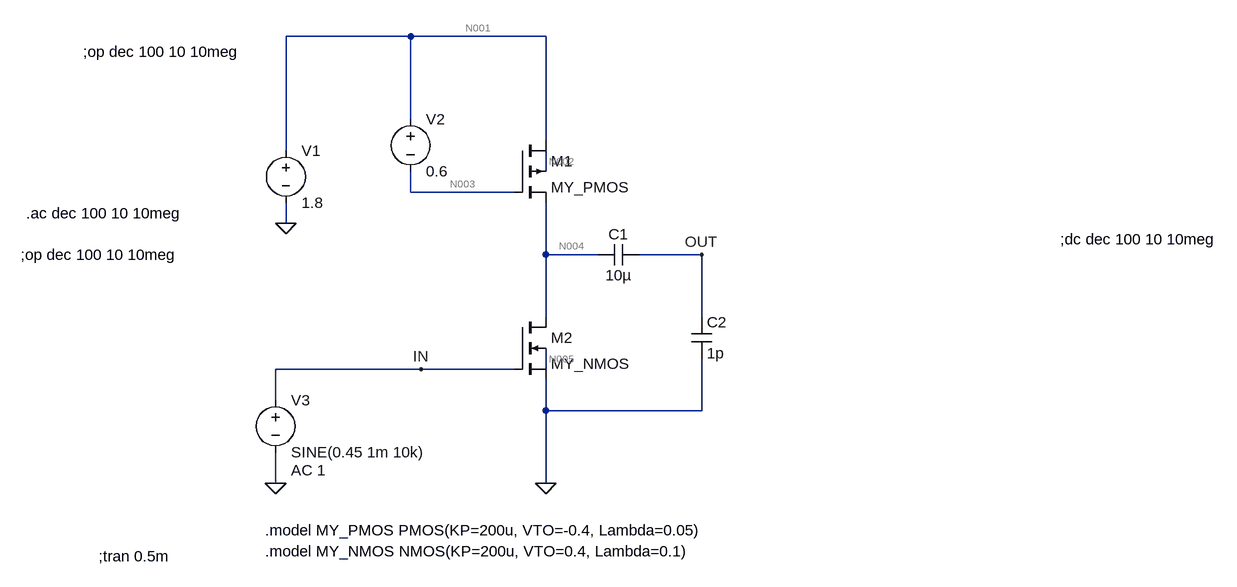
[diagram p0: schematic cs_amp_activeload.asc]
cs_amp_activeload.asc, the LTspice schematic file:
Version 4
SHEET 1 1208 680
WIRE -80 -304 -272 -304
WIRE 128 -304 -80 -304
WIRE -80 -176 -80 -304
WIRE 128 -144 128 -304
WIRE -272 -128 -272 -304
WIRE 128 -96 128 -128
WIRE -80 -64 -80 -96
WIRE 80 -64 -80 -64
WIRE -272 -16 -272 -48
WIRE 128 32 128 -48
WIRE 208 32 128 32
WIRE 368 32 272 32
WIRE 128 128 128 32
WIRE 368 128 368 32
WIRE -64 208 -288 208
WIRE 80 208 -64 208
WIRE 128 208 128 176
WIRE -288 256 -288 208
WIRE 128 272 128 224
WIRE 368 272 368 192
WIRE 368 272 128 272
WIRE -288 384 -288 336
WIRE 128 384 128 272
FLAG -272 -16 0
FLAG -288 384 0
FLAG 128 384 0
FLAG -64 208 IN
FLAG 368 32 OUT
SYMBOL pmos4 80 -144 R0
SYMATTR InstName M1
SYMATTR Value MY_PMOS
SYMATTR Value2 l=180n w=1800n
SYMBOL nmos4 80 128 R0
SYMATTR InstName M2
SYMATTR Value MY_NMOS
SYMATTR Value2 l=180n w=28.8u
SYMBOL voltage -272 -144 R0
WINDOW 123 0 0 Left 0
WINDOW 39 0 0 Left 0
SYMATTR InstName V1
SYMATTR Value 1.8
SYMBOL voltage -80 -192 R0
WINDOW 123 0 0 Left 0
WINDOW 39 0 0 Left 0
SYMATTR InstName V2
SYMATTR Value 0.6
SYMBOL voltage -288 240 R0
WINDOW 123 24 124 Left 2
WINDOW 39 0 0 Left 0
SYMATTR Value2 AC 1
SYMATTR InstName V3
SYMATTR Value SINE(0.45 1m 10k)
SYMBOL cap 272 16 R90
WINDOW 0 0 32 VBottom 2
WINDOW 3 32 32 VTop 2
SYMATTR InstName C1
SYMATTR Value 10µ
SYMBOL cap 352 128 R0
SYMATTR InstName C2
SYMATTR Value 1p
TEXT -304 456 Left 2 !.model MY_PMOS PMOS(KP=200u, VTO=-0.4, Lambda=0.05)
TEXT -304 488 Left 2 !.model MY_NMOS NMOS(KP=200u, VTO=0.4, Lambda=0.1)
TEXT -560 496 Left 2 !;tran 0.5m
TEXT -584 -280 Left 2 !;op dec 100 10 10meg
TEXT -680 32 Left 2 !;op dec 100 10 10meg
TEXT -672 -32 Left 2 !.ac dec 100 10 10meg
TEXT 920 8 Left 2 !;dc dec 100 10 10meg

The netlist it stands for:
* cs_amp_activeload.asc
M1 N001 N003 N004 N002 MY_PMOS l=180n w=1800n
M2 N004 IN 0 N005 MY_NMOS l=180n w=28.8u
V1 N001 0 1.8
V2 N001 N003 0.6
V3 IN 0 SINE(0.45 1m 10k) AC 1
C1 OUT N004 10µ
C2 OUT 0 1p
.model NMOS NMOS
.model PMOS PMOS
.lib standard.mos
.model MY_PMOS PMOS(KP=200u, VTO=-0.4, Lambda=0.05)
.model MY_NMOS NMOS(KP=200u, VTO=0.4, Lambda=0.1)
;tran 0.5m
;op dec 100 10 10meg
;op dec 100 10 10meg
.ac dec 100 10 10meg
;dc dec 100 10 10meg
.backanno
.end

* Results of the author's LTspice run, read from the files saved beside the schematic
* Operating Point, zero values left out:
*   V(n001) = 1.8 V
*   V(n003) = 1.2 V
*   V(n004) = 600 mV
*   V(n002) = 1.656 V
*   V(in) = 450 mV
*   V(n005) = 91.6 mV
*   V(out) = 6 µV
*   Id(M2) = 42.4 µA
*   Is(M2) = -42.4 µA
*   Id(M1) = 42.4 µA
*   Ib(M1) = -1.656 pA
*   Is(M1) = -42.4 µA
*   I(V1) = -42.4 µA
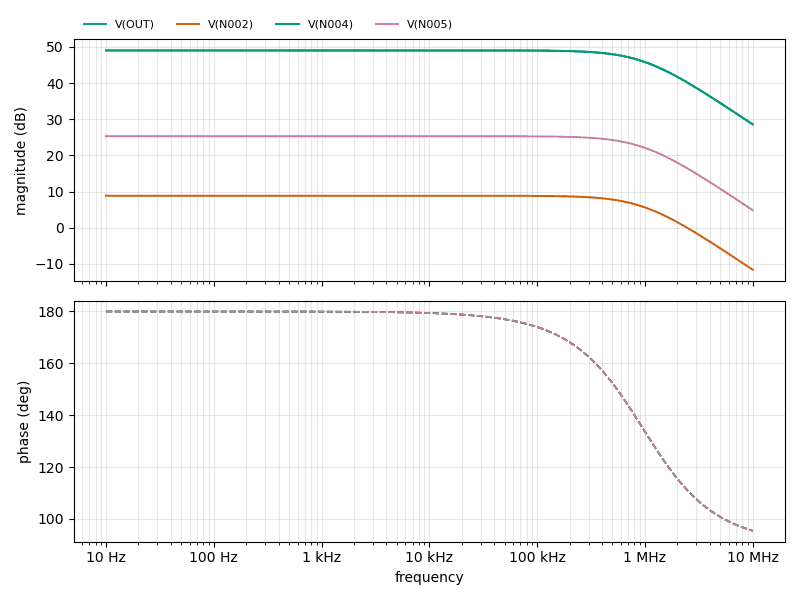
[diagram p1: AC Analysis of cs_amp_activeload.asc, plotted from the saved traces]
* AC Analysis, 1 run:
*   V(OUT): 49.03 dB at 10 Hz, 28.59 dB at 10 MHz, peak 49.03 dB at 10 Hz, 3 dB below the peak at 954.9 kHz
*   V(N002): 8.85 dB at 10 Hz, -11.59 dB at 10 MHz, peak 8.85 dB at 10 Hz, 3 dB below the peak at 954.9 kHz
*   V(N004): 49.03 dB at 10 Hz, 28.59 dB at 10 MHz, peak 49.03 dB at 10 Hz, 3 dB below the peak at 954.9 kHz
*   V(N005): 25.31 dB at 10 Hz, 4.87 dB at 10 MHz, peak 25.31 dB at 10 Hz, 3 dB below the peak at 954.9 kHz